# EasyEDA Pro project AD5933阻抗测量模块.eprj

# Schematic Schematic1
Create Date: 2024-03-29; Page Name: P1; Project Name: AD5933阻抗测量模块; Schematic Name: Schematic1; Update Date: 2024-03-29; Company: 嘉立创EDA; Page Size: A4; Version: V1.0
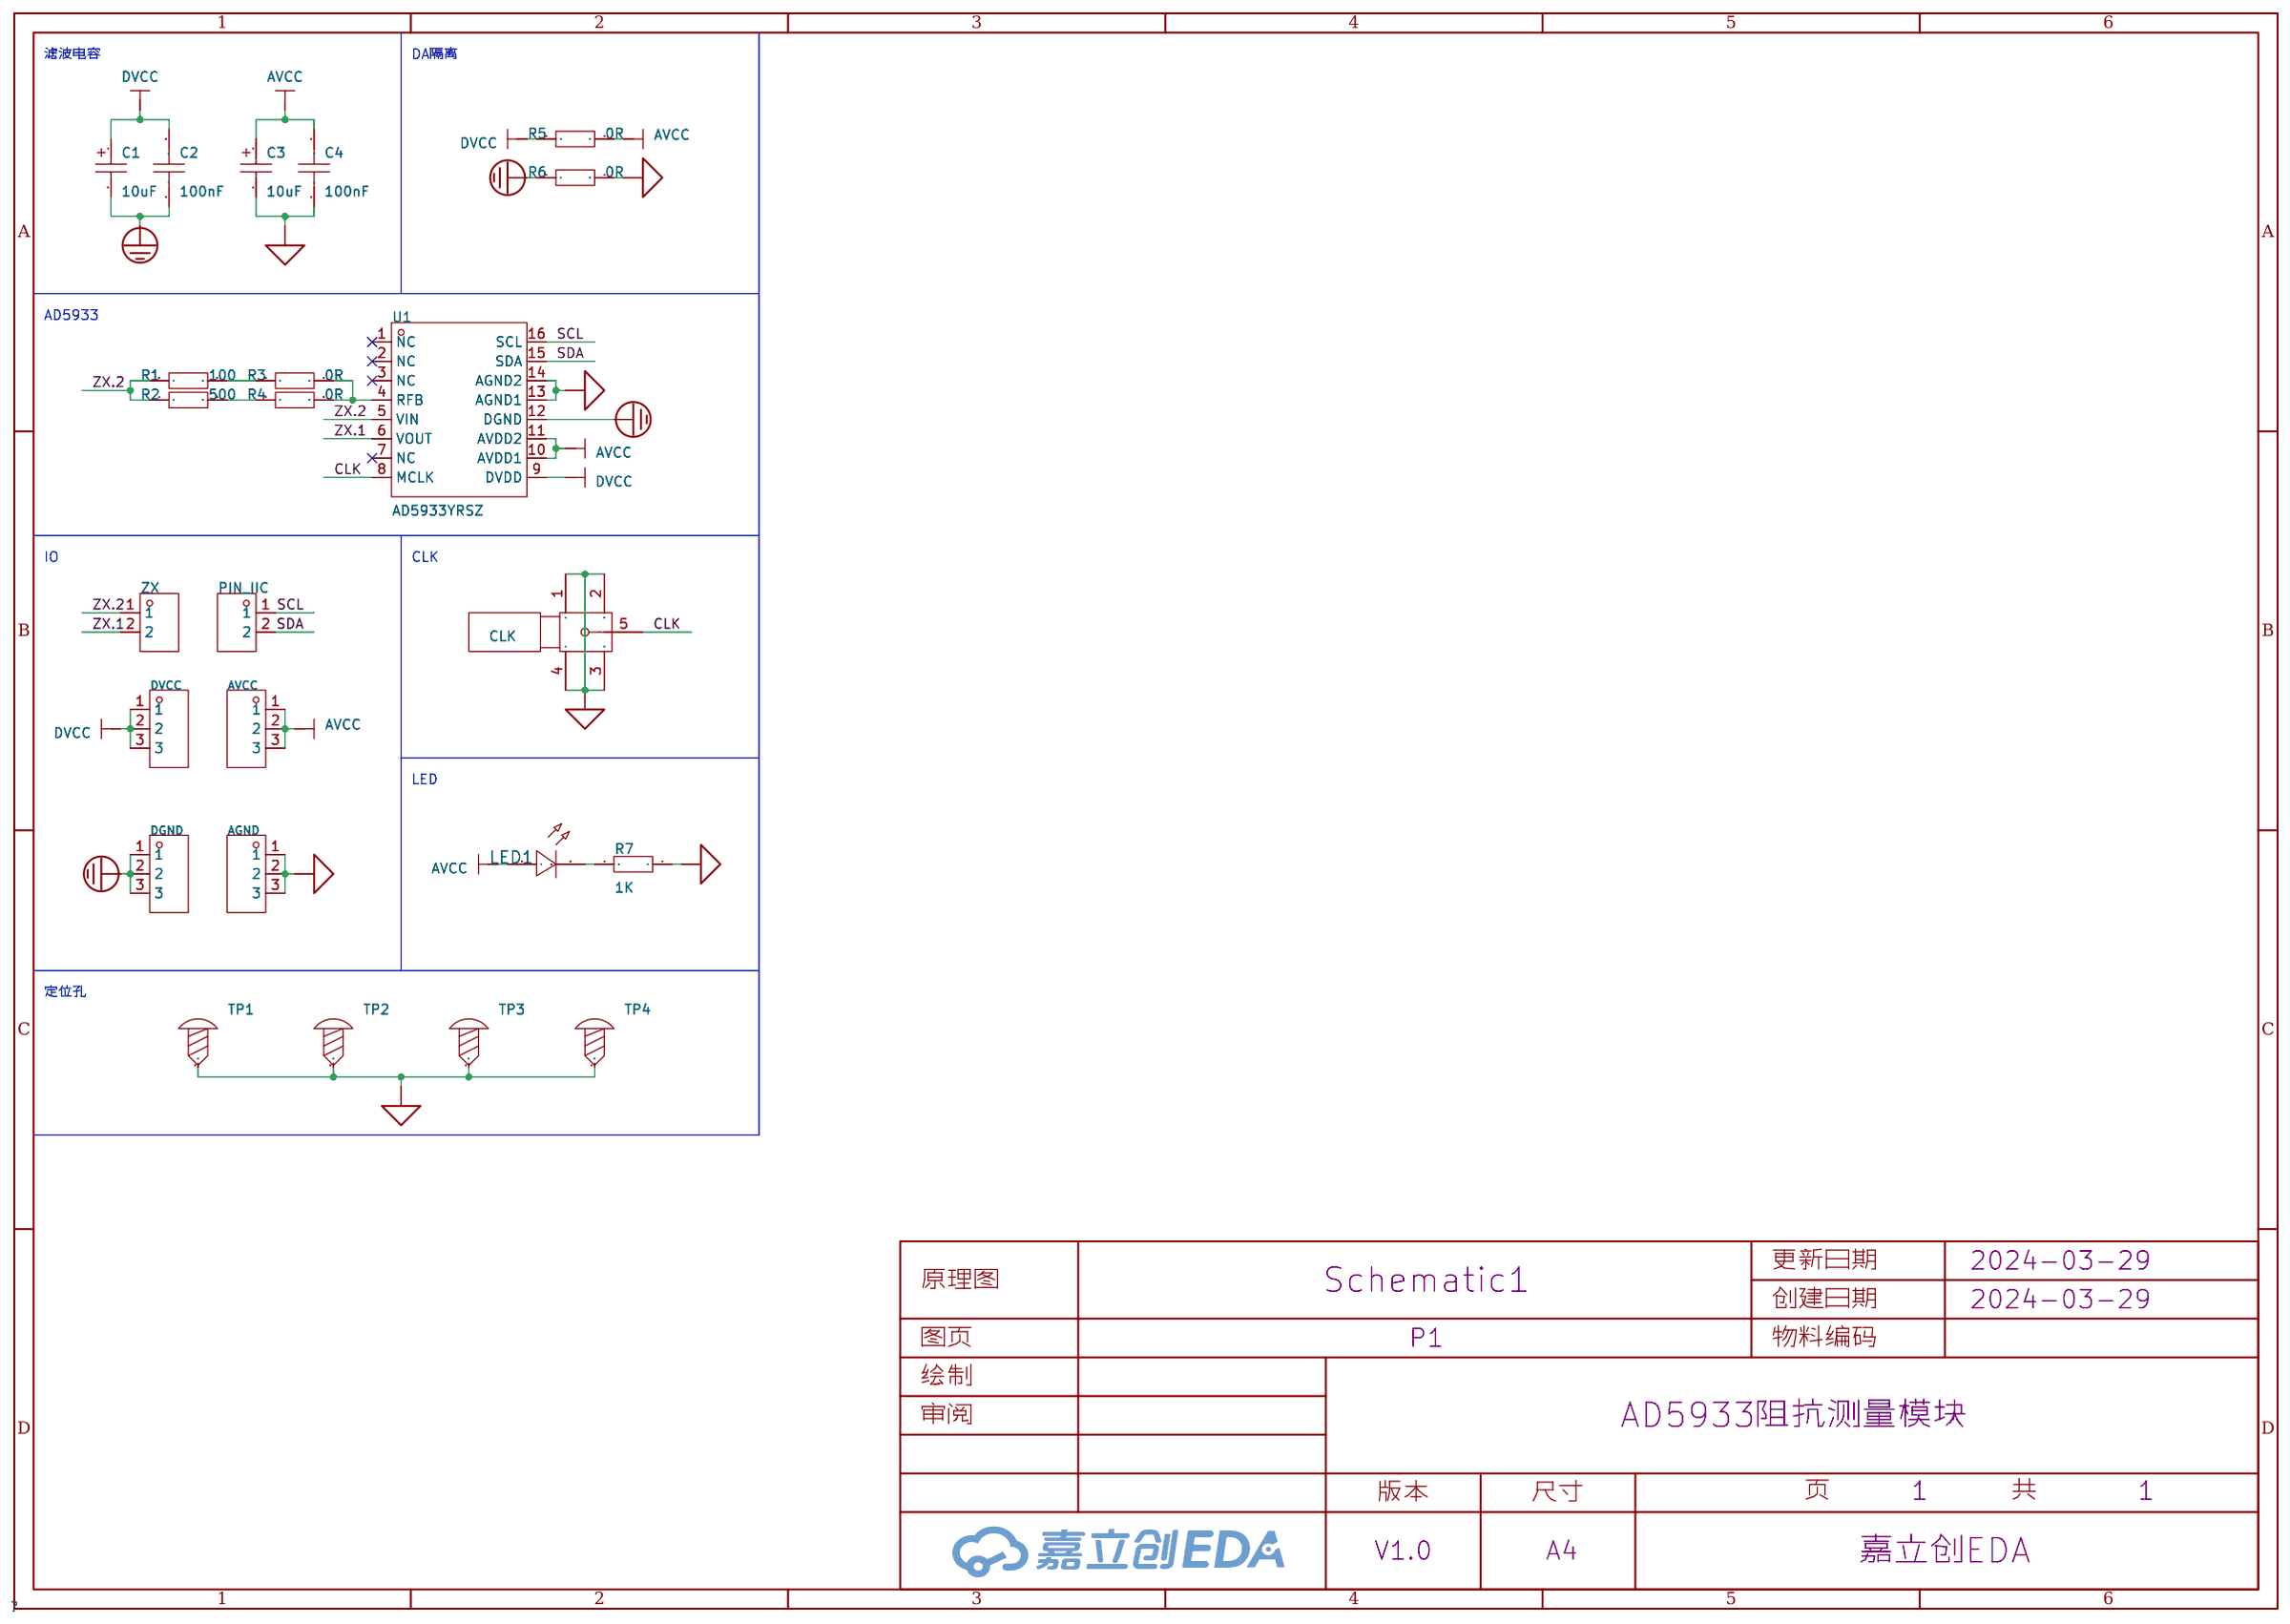
[diagram p0: schematic sheet]

## Parts
AGND  -  [HDR-TH_3P-P2.54-V-F]
AVCC  -  [HDR-TH_3P-P2.54-V-F]
C1  10uF  [CAP-SMD_L3.2-W1.6-RD-C7171]
C2  100nF  [C0603]
C3  10uF  [CAP-SMD_L3.2-W1.6-RD-C7171]
C4  100nF  [C0603]
CLK  BWSMA-KE-Z001  [SMA-TH_BWSMA-KE-Z001]
DGND  -  [HDR-TH_3P-P2.54-V-F]
DVCC  -  [HDR-TH_3P-P2.54-V-F]
LED1  -  [LED_0603]
PIN_IIC  ZX-XH2.54-2PZZ  [CONN-TH_2P-P2.50_HX25003-2A]
R1  100  [R0603]
R2  500  [R0603]
R3  0R  [R0603]
R4  0R  [R0603]
R5  0R  [R0603]
R6  0R  [R0603]
R7  1K  [R0603]
TP1  -  [M3螺丝]
TP2  -  [M3螺丝]
TP3  -  [M3螺丝]
TP4  -  [M3螺丝]
U1  AD5933YRSZ  [SSOP-16_L6.2-W5.3-P0.65-LS7.8-BL]
ZX  DB301V-3.5-2P-GN-S  [CONN-TH_DB301V-3.5-2P-GN]

## Library data of the parts
AGND AVCC DGND DVCC = HDR-F_2.54_1x3P: Supplier Part: C541850; Supplier Footprint: 插件
C1 C3 = TAJA106K016RNJ: 容值:10uF;精度:±10%;额定电压:16V;等效串联电阻:3Ω@100kHz;; LCSC Part Name: 10uF ±10% 16V; Supplier Part: C7171; Manufacturer: Kyocera AVX; Supplier Footprint: CASE-A-3216; JLCPCB Part Class: 基础库; Datasheet: https://atta.szlcsc.com/upload/public/pdf/source/20160107/1457707750344.pdf; Supplier: LCSC; Tolerance: ±10%; Rated Voltage: 16V; Equivalent Series Resistance(ESR): 3Ω@100kHz; Operating Temperature: -55℃~+125℃
C2 C4 = CAP_0603: Supplier Footprint: 0603
CLK = BWSMA-KE-Z001_C496549: 连接器类型:板端;接口类型:内孔;端口数量:1;接口直径:-;接口长度/高度:-;频率-最大值:-;射频系列:SMA;阻抗:50Ω;样式:正脚;触头材质:-;触头镀层:-;工作温度范围:-65℃~+165℃;焊接温度(最大值):-;; LCSC Part Name: 内孔 SMA 正脚; Supplier Part: C496549; Manufacturer: BAT WIRELESS(蝙蝠无线); Supplier Footprint: 插件; JLCPCB Part Class: 扩展库; Datasheet: https://atta.szlcsc.com/upload/public/pdf/source/20221228/40BF41E56A06003A0210E1785CA66EA6.pdf; Supplier: LCSC; Connector Type: 板端; Interface Type: 内孔; Number of Ports: 1; RF Series: SMA; Impedance: 50Ω; Style: 正脚; Operating Temperature Range: -65℃~+165℃
LED1 = LED_0603-R: Supplier Footprint: 0603
PIN_IIC = ZX-XH2.54-2PZZ: 插针结构:1x2P;间距:2.54mm;安装方式:直插;参考系列:XH;总PIN数:2P;排数:1;每排PIN数:2;行距:-;额定电流:3A;触头材质:黄铜;触头镀层:锡;工作温度范围:-25℃~+85℃;; Supplier Part: C7429632; Manufacturer: Megastar(兆星); Supplier Footprint: 插件,P=2.54mm; JLCPCB Part Class: 扩展库; Datasheet: https://atta.szlcsc.com/upload/public/pdf/source/20230619/19BA6947230AA44A04D3EDD65E618FD0.pdf; Supplier: LCSC; Pins Structure: 1x2P; Pitch: 2.54mm; Mounting Style: 直插; Reference Series: XH; Number of Pins: 2P; Number of Rows: 1; Number of PINs Per Row: 2; Current Rating (Max): 3A; Contact Material: 黄铜; Contact Plating: 锡; Operating Temperature Range: -25℃~+85℃
R1-R7 = Res_0603: Supplier Footprint: 0603
TP1-TP4 = M3螺丝: Supplier Footprint: 插件
U1 = AD5933YRSZ: 自宽调谐(最大值):-;; Supplier Part: C578324; Manufacturer: ADI(亚德诺); Supplier Footprint: SSOP-16-208mil; JLCPCB Part Class: 扩展库; Datasheet: https://atta.szlcsc.com/upload/public/pdf/source/20210224/C578324_9EDCF4E5C1159F060079EFC2100F36DA.pdf; Supplier: LCSC
ZX = DB301V-3.5-2P-GN-S: 结构:1x2P;间距:3.5mm;颜色:绿色;安装方式:直插;额定电流:10A;额定电压:130V;排数:1;线规 - AWG:18~24;线规 - 平方毫米:0.5~1;每排PIN数:2;工作温度范围:-40℃~+105℃;; LCSC Part Name: 3.5mm 1x2P 排数:1 每排P数:2 直插; Supplier Part: C695629; Manufacturer: DORABO(地博电气); Supplier Footprint: 插件,P=3.5mm; JLCPCB Part Class: 扩展库; Datasheet: https://atta.szlcsc.com/upload/public/pdf/source/20230106/1B95616A85A883CA085E21635C8A8490.pdf; Supplier: LCSC; Structure: 1x2P; Pitch: 3.5mm; Color: 绿色; Mounting Style: 直插; Current Rating (Max): 10A; Voltage Rating (Max): 130V; Number of Pins: 2P; Number of Rows: 1; Wire Gauge - AWG: 18~24; Wire Gauge - mm2: 0.5~1; Number of PINs Per Row: 2; Operating Temperature Range: -40℃~+105℃

## Nets
AGND: AGND.1 AGND.2 AGND.3 C3.2 C4.1 CLK.1 CLK.2 CLK.3 CLK.4 R6.2 R7.1 TP1.1 TP2.1 TP3.1 TP4.1 U1.13(AGND1) U1.14(AGND2)
AVCC: AVCC.1 AVCC.2 AVCC.3 C3.1 C4.2 LED1.2(A) R5.2 U1.10(AVDD1) U1.11(AVDD2)
DVCC: C1.1 C2.2 DVCC.1 DVCC.2 DVCC.3 R5.1 U1.9(DVDD)
PGND: C1.2 C2.1 DGND.1 DGND.2 DGND.3 R6.1 U1.12(DGND)
CLK: CLK.5 U1.8(MCLK)
SCL: PIN_IIC.1 U1.16(SCL)
SDA: PIN_IIC.2 U1.15(SDA)
ZX.1: U1.6(VOUT) ZX.2
ZX.2: R1.1 R2.1 U1.5(VIN) ZX.1
$1N938: R3.2 R4.2 U1.4(RFB)
$1N947: R2.2 R4.1
$1N955: R1.2 R3.1
$1N1666: LED1.1(C) R7.2

Not connected (* = marked no-connect by the designer): U1 1(NC)* 2(NC)* 3(NC)* 7(NC)*

## Notes on the sheet
- 滤波电容
- DA隔离
- AD5933
- IO
- CLK
- LED
- 定位孔

# Board PCB1
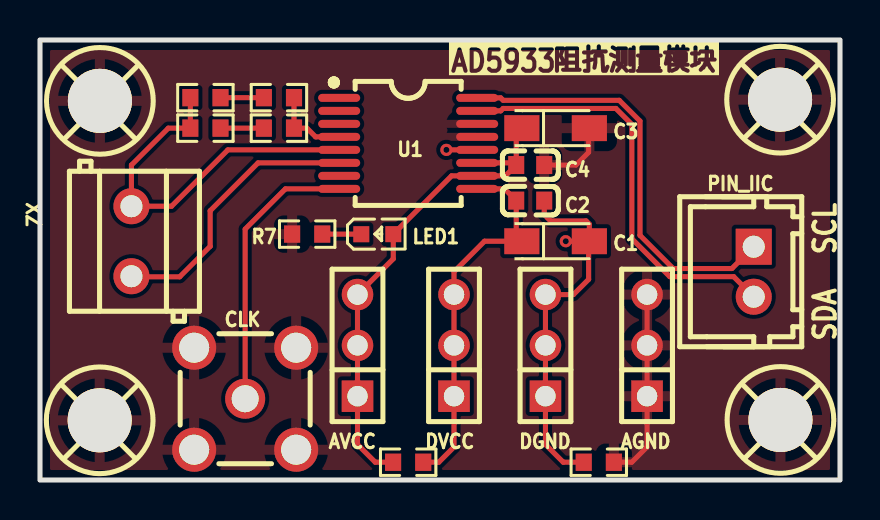
[diagram p1: board, top side]
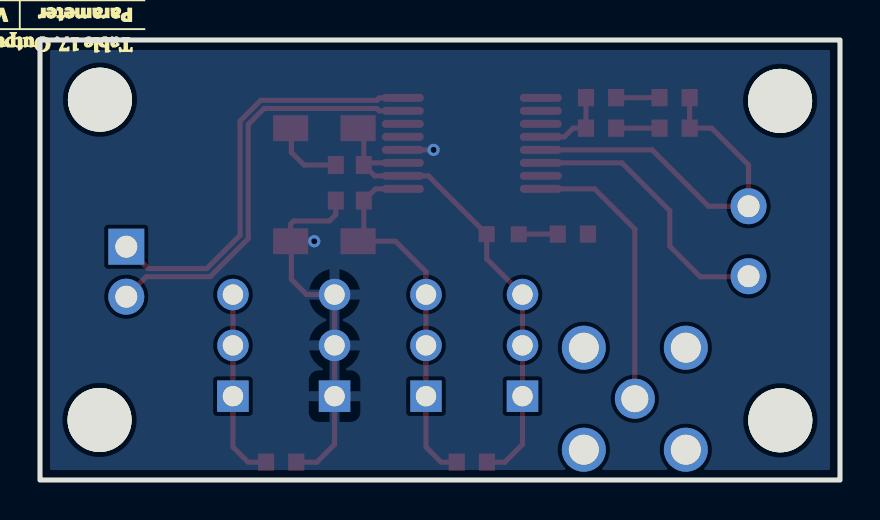
[diagram p2: board, bottom side, seen from below]

Outline 40 x 22 mm; copper layers: Top Layer, Bottom Layer. Coordinates in mm from the lower left corner of the outline.
Outline path: rectangle 0,22 40,0
Stack: Top Layer 0.035mm / Dielectric1 1.51mm FR4 er 4.5 / Bottom Layer 0.035mm

## Design rules (mm)
net SCL: IIC
net SDA: IIC
template: JLCPCB Capability(Two Layers Board)
spacing copperThickness1oz (default): track to track 0.102, other pairs 0.152 to 0.3
spacing copperThickness2oz: track to track 0.203, other pairs 0.152 to 0.3
track width copperThickness1oz (default): min 0.127, default 0.254, max 2.54
track width copperThickness2oz: min 0.203, default 0.254, max 2.54
differential pair differentialPair (default): width min 0.127, default 0.254, max 2.54; gap min 0.152, default 0.152
via viaSize (default): diameter min 0.5, default 0.61, max 10; hole min 0.3, default 0.305, max 6.3

## Placement (name value [footprint] x y rotation side)
AGND  -  [HDR-TH_3P-P2.54-V-F]  30.35 6.73 90 top
AVCC  -  [HDR-TH_3P-P2.54-V-F]  15.88 6.73 90 top
C1  10uF  [CAP-SMD_L3.2-W1.6-RD-C7171]  25.78 11.94 0 top
C2  100nF  [C0603]  24.51 13.97 180 top
C3  10uF  [CAP-SMD_L3.2-W1.6-RD-C7171]  25.78 17.59 0 top
C4  100nF  [C0603]  24.51 15.75 180 top
CLK  BWSMA-KE-Z001  [SMA-TH_BWSMA-KE-Z001]  10.26 4.06 0 top
DGND  -  [HDR-TH_3P-P2.54-V-F]  25.27 6.73 90 top
DVCC  -  [HDR-TH_3P-P2.54-V-F]  20.7 6.73 90 top
LED1  -  [LED_0603]  16.91 12.3 0 top
PIN_IIC  ZX-XH2.54-2PZZ  [CONN-TH_2P-P2.50_HX25003-2A]  35.69 10.41 270 top
R1  100  [R0603]  8.27 19.12 0 top
R2  500  [R0603]  8.27 17.59 0 top
R3  0R  [R0603]  11.95 19.12 0 top
R4  0R  [R0603]  11.95 17.59 0 top
R5  0R  [R0603]  18.41 0.89 180 top
R6  0R  [R0603]  27.94 0.89 0 top
R7  1K  [R0603]  13.36 12.3 0 top
TP1  -  [M3螺丝]  3.05 2.92 0 top
TP2  -  [M3螺丝]  3.06 18.89 0 top
TP3  -  [M3螺丝]  37.07 18.95 0 top
TP4  -  [M3螺丝]  37.09 2.94 0 top
U1  AD5933YRSZ  [SSOP-16_L6.2-W5.3-P0.65-LS7.8-BL]  18.41 16.83 270 top
ZX  DB301V-3.5-2P-GN-S  [CONN-TH_DB301V-3.5-2P-GN]  4.57 11.94 270 top

## Footprints (pads in the part's own frame, mm; a bottom-side part is the same pattern mirrored in y, then rotated)
C0603
  rect 0.8x0.9 smd: 1(-0.7,0) 2(0.7,0)
CAP-SMD_L3.2-W1.6-RD-C7171
  rect 1.758x1.296 smd: 1(-1.687,0) 2(1.687,0)
CONN-TH_2P-P2.50_HX25003-2A
  rect 1.8x1.8 hole 1.1: 1(-1.25,0)
  round 1.8 hole 1.1: 2(1.25,0)
CONN-TH_DB301V-3.5-2P-GN
  round 1.8 hole 1.1: 1(-1.75,0) 2(1.75,0)
HDR-TH_3P-P2.54-V-F
  rect 1.575x1.575 hole 1.02: 1(-2.54,0)
  round 1.575 hole 1.02: 2(0,0) 3(2.54,0)
LED_0603
  rect 0.8x0.8 smd: 1(-0.851,-0.01) 2(0.75,-0.005)
M3螺丝
  round 3.2 hole 3.2: 1(-0.064,0.064)
R0603
  rect 0.806x0.864 smd: 1(-0.753,0) 2(0.753,0)
SMA-TH_BWSMA-KE-Z001
  round 2.2 hole 1.5: 1(-2.55,-2.55) 2(-2.55,2.55) 3(2.55,2.55) 4(2.55,-2.55)
  round 2 hole 1.35: 5(0,0)
SSOP-16_L6.2-W5.3-P0.65-LS7.8-BL
  oval 0.4x2.1 smd: 1(-2.275,-3.45) 2(-1.625,-3.45) 3(-0.975,-3.45) 4(-0.325,-3.45) 5(0.325,-3.45) 6(0.975,-3.45) 7(1.625,-3.45) 8(2.275,-3.45) 9(2.275,3.45) 10(1.625,3.45) 11(0.975,3.45) 12(0.325,3.45) 13(-0.325,3.45) 14(-0.975,3.45) 15(-1.625,3.45) 16(-2.275,3.45)

## Nets
As in the schematic.

Pads without a net: U1 1 2 3 7

## Via types
v1: diameter 0.61, hole 0.305, Top Layer to Bottom Layer, 2 vias

## Routing (per net, layer and track width the routed paths; a pad name or vN(x,y) marks a point on that pad's centre or on a via; arc(x,y) is an arc through that point)
AGND: length 13.3
  Top Layer w0.254: C3.2 27.43,17.56 27.43,16.38 26.8,15.75 25.21,15.75 ; R6.2 29.59,0.89 30.35,1.65 AGND.2 AGND.3
AVCC: length 24.9
  Top Layer w0.254: C4.2 23.7,15.86 U1.11 ; C4.2 23.81,17.31 C3.1 ; C4.2 23.27,15.21 U1.10 20.58,15.21 LED1.2 17.66,11.06 AVCC.3 AVCC.2 15.88,1.78 16.76,0.89 R5.2
DVCC: length 19
  Top Layer w0.254: U1.9 23.22,14.56 C2.2 23.81,12.22 C1.1 22.22,11.94 20.7,10.41 DVCC.3 DVCC.2 20.7,1.65 19.94,0.89 R5.1
PGND: length 20.9
  Top Layer w0.254: C1.2 v1(26.29,11.94) ; C1.2 27.47,12.79 27.31,12.95 25.53,12.95 25.21,13.27 25.21,13.97 ; C1.2 27.43,11.9 27.43,10.03 26.67,9.27 DGND.3 DGND.2 25.27,1.78 26.16,0.89 R6.1 ; U1.12 v1(20.32,16.51)
CLK: length 14
  Top Layer w0.254: CLK.5 10.26,12.54 12.27,14.56 U1.8
SCL: length 21.2
  Top Layer w0.254: U1.16 23.04,19.11 23.16,18.98 28.96,18.98 30,17.95 30,12.23 31.66,10.57 34.6,10.57 PIN_IIC.1
SDA: length 21.1
  Top Layer w0.254: U1.15 23.04,18.46 23.16,18.58 28.79,18.58 29.59,17.78 29.59,12.06 31.49,10.17 34.68,10.17 PIN_IIC.2
ZX.1: length 13.8
  Top Layer w0.254: U1.6 10.9,15.86 8.51,13.46 8.51,11.68 6.99,10.16 4.6,10.16 ZX.2
ZX.2: length 18.8
  Top Layer w0.254: U1.5 9.39,16.51 6.58,13.69 ZX.1 4.57,15.75 6.42,17.59 7.52,17.59 7.52,19.12
$1N938: length 4
  Top Layer w0.254: U1.4 13.78,17.16 13.34,17.59 R4.2 R3.2
$1N947: length 2.2
  Top Layer w0.254: R2.2 R4.1
$1N955: length 2.2
  Top Layer w0.254: R1.2 R3.1
$1N1666: length 2
  Top Layer w0.254: R7.2 16.06,12.3 LED1.1

## Copper pours and planes (outline as drawn; the poured copper is in the pictures)
AGND on Top Layer: -0.76,22.61 40.64,22.61 40.64,-0.51 -0.76,-0.51
PGND on Bottom Layer: -0.76,22.61 40.64,22.61 40.64,-0.64 -0.76,-0.64

## Text on the board
Top Silkscreen Layer: SCL | SDA | AD5933阻抗测量模块
